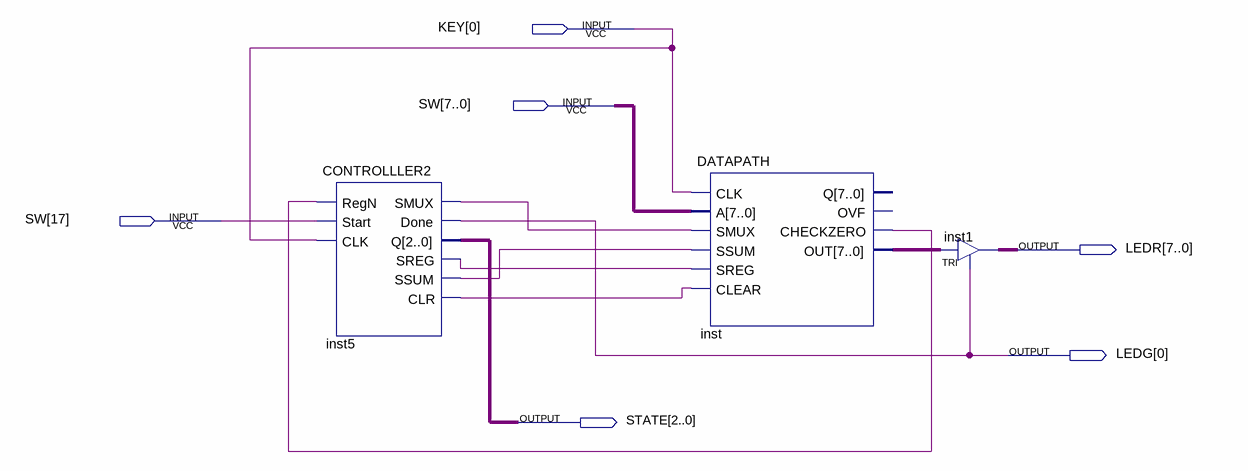
[diagram p0: schematic sheet]
// Quartus schematic Block1.bdf as structural Verilog: 3 symbols, 6 pins
module Block1 (
  input  [0:0] KEY,
  input  [17:0] SW,
  output [7:0] LEDR,
  output [0:0] LEDG,
  output [2:0] STATE
);

  wire inst5_clr, inst5_smux, inst5_sreg, inst5_ssum, inst_checkzero;
  wire [7:0] inst_out;

  CONTROLLLER2 inst5 (
    .RegN(inst_checkzero), .Start(SW[17]), .CLK(KEY[0]), .SMUX(inst5_smux), .Done(LEDG[0]), .Q(STATE),
    .SREG(inst5_sreg), .SSUM(inst5_ssum), .CLR(inst5_clr));
  DATAPATH inst (
    .CLK(KEY[0]), .A(SW[7:0]), .SMUX(inst5_smux), .SSUM(inst5_ssum), .SREG(inst5_sreg), .CLEAR(inst5_clr),
    .CHECKZERO(inst_checkzero), .OUT(inst_out));  // open: Q, OVF
  TRI inst1[7:0] (.IN(inst_out), .OE(LEDG[0]), .OUT(LEDR));
endmodule
